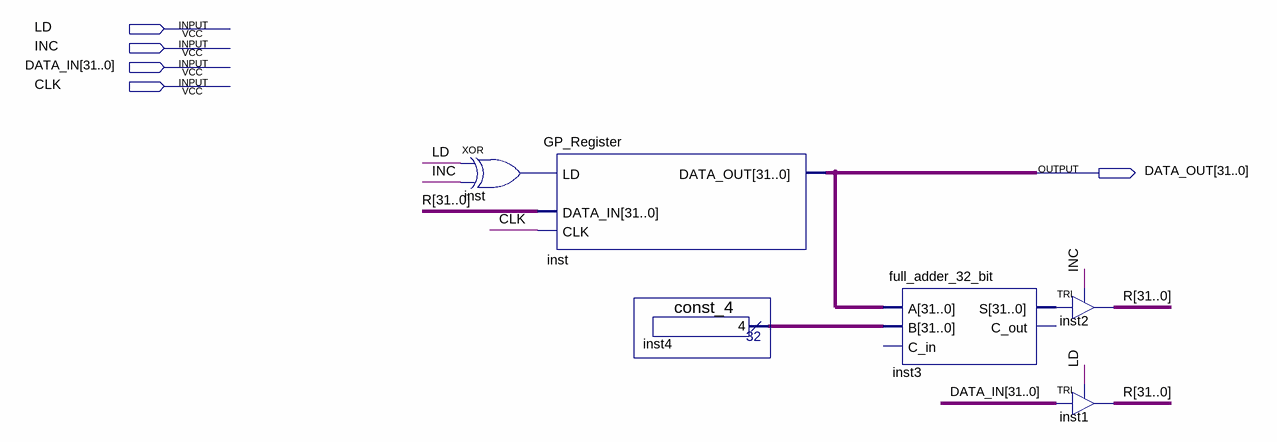
[diagram p0: schematic sheet]
// Quartus schematic INC_Register.bdf as structural Verilog: 6 symbols, 5 pins
module INC_Register (
  input  LD,
  input  INC,
  input  [31:0] DATA_IN,
  input  CLK,
  output [31:0] DATA_OUT
);

  wire inst_out;
  wire [31:0] inst3_s, inst4_result, R;

  xor inst (inst_out, LD, INC);
  GP_Register inst_dup2 (.LD(inst_out), .DATA_IN(R), .CLK(CLK), .DATA_OUT(DATA_OUT));
  const_4 inst4 (.result(inst4_result));
  full_adder_32_bit inst3 (.A(DATA_OUT), .B(inst4_result), .S(inst3_s));  // open: C_in, C_out
  TRI inst2[31:0] (.IN(inst3_s), .OE(INC), .OUT(R));
  TRI inst1[31:0] (.IN(DATA_IN), .OE(LD), .OUT(R));
endmodule
